# Altium schematic sheet ADC_REF_07.SchDoc
size A4; SheetNumber: 7; SheetTotal: 9
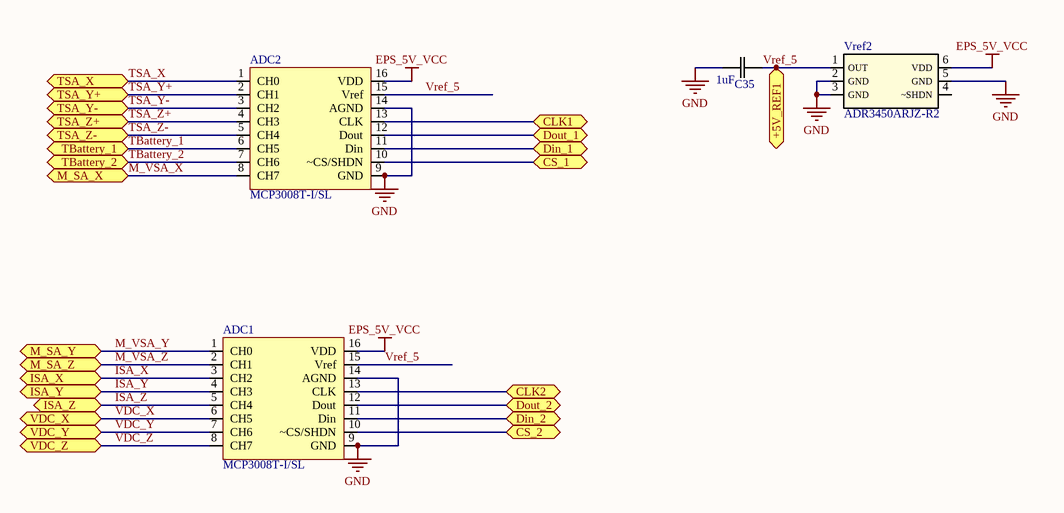
[diagram p0: ADC_REF_07.SchDoc]

## Parts
ADC1  MCP3008T-I/SL  [SOIC16_L]
ADC2  MCP3008T-I/SL  [SOIC16_L]
C35  1uF  [0805]
Vref2  ADR3450ARJZ-R2  [RJ_6-M]

## Ports
+5V_REF1, CLK1, CLK2, CS_1, CS_2, Din_1, Din_2, Dout_1, Dout_2, ISA_X, ISA_Y, ISA_Z, M_SA_X, M_SA_Y, M_SA_Z, TBattery_1, TBattery_2, TSA_X, TSA_Y+, TSA_Y-, TSA_Z+, TSA_Z-, VDC_X, VDC_Y, VDC_Z

## Nets
EPS_5V_VCC: ADC1.16(VDD) ADC2.16(VDD) Vref2.6(VDD)
GND: ADC1.9(GND) ADC1.14(AGND) ADC2.9(GND) ADC2.14(AGND) C35.1 Vref2.2(GND) Vref2.3(GND) Vref2.5(GND)
CLK1: ADC2.13(CLK) ; port CLK1
CLK2: ADC1.13(CLK) ; port CLK2
CS_1: ADC2.10(~CS/SHDN) ; port CS_1
CS_2: ADC1.10(~CS/SHDN) ; port CS_2
Din_1: ADC2.11(Din) ; port Din_1
Din_2: ADC1.11(Din) ; port Din_2
Dout_1: ADC2.12(Dout) ; port Dout_1
Dout_2: ADC1.12(Dout) ; port Dout_2
ISA_X: ADC1.3(CH2) ; port ISA_X
ISA_Y: ADC1.4(CH3) ; port ISA_Y
ISA_Z: ADC1.5(CH4) ; port ISA_Z
M_VSA_X: ADC2.8(CH7) ; port M_SA_X
M_VSA_Y: ADC1.1(CH0) ; port M_SA_Y
M_VSA_Z: ADC1.2(CH1) ; port M_SA_Z
TBattery_1: ADC2.6(CH5) ; port TBattery_1
TBattery_2: ADC2.7(CH6) ; port TBattery_2
TSA_X: ADC2.1(CH0) ; port TSA_X
TSA_Y+: ADC2.2(CH1) ; port TSA_Y+
TSA_Y-: ADC2.3(CH2) ; port TSA_Y-
TSA_Z+: ADC2.4(CH3) ; port TSA_Z+
TSA_Z-: ADC2.5(CH4) ; port TSA_Z-
VDC_X: ADC1.6(CH5) ; port VDC_X
VDC_Y: ADC1.7(CH6) ; port VDC_Y
VDC_Z: ADC1.8(CH7) ; port VDC_Z
Vref_5: ADC1.15(Vref) ADC2.15(Vref) C35.2 Vref2.1(OUT) ; port +5V_REF1

Not connected (* = marked no-connect by the designer): Vref2 4(~SHDN)

## Library data of the parts
ADC1 ADC2 = MCP3008T-I/SL: Analog  to Digital Converter, 10BIT 8 Channel; Digi-Key Part Number: MCP3008T-I/SLCT-ND; Manufacturer Part Number: MCP3008T-I/SL; Package/Case: SOIC-16
C35 = GRM155R71H103KA8: Ceramic Capacitor 0402; Manufacturer_Part_Number: GRM155R71H103KA88D; Vendor: Murata; C: Copyright (C) 2015 Accelerated Designs. All rights reserved; Copyright: Copyright (C) 2015 Accelerated Designs. All rights reserved; Value: Value; Package/Case: 0402(1005metric)
Vref2 = ADR3412ARJZ-R2: Voltage Reference; Vendor: Analog Devices Inc; C: Copyright (C) 2015 Accelerated Designs. All rights reserved; Manufacturer_Part_Number: adr3412arjz-r2; Value: Value; Type: Type; RefDes: RefDes; Package/Case: SOT23-6